# Altium schematic sheet IMU.SchDoc
size 381 x 241 mm
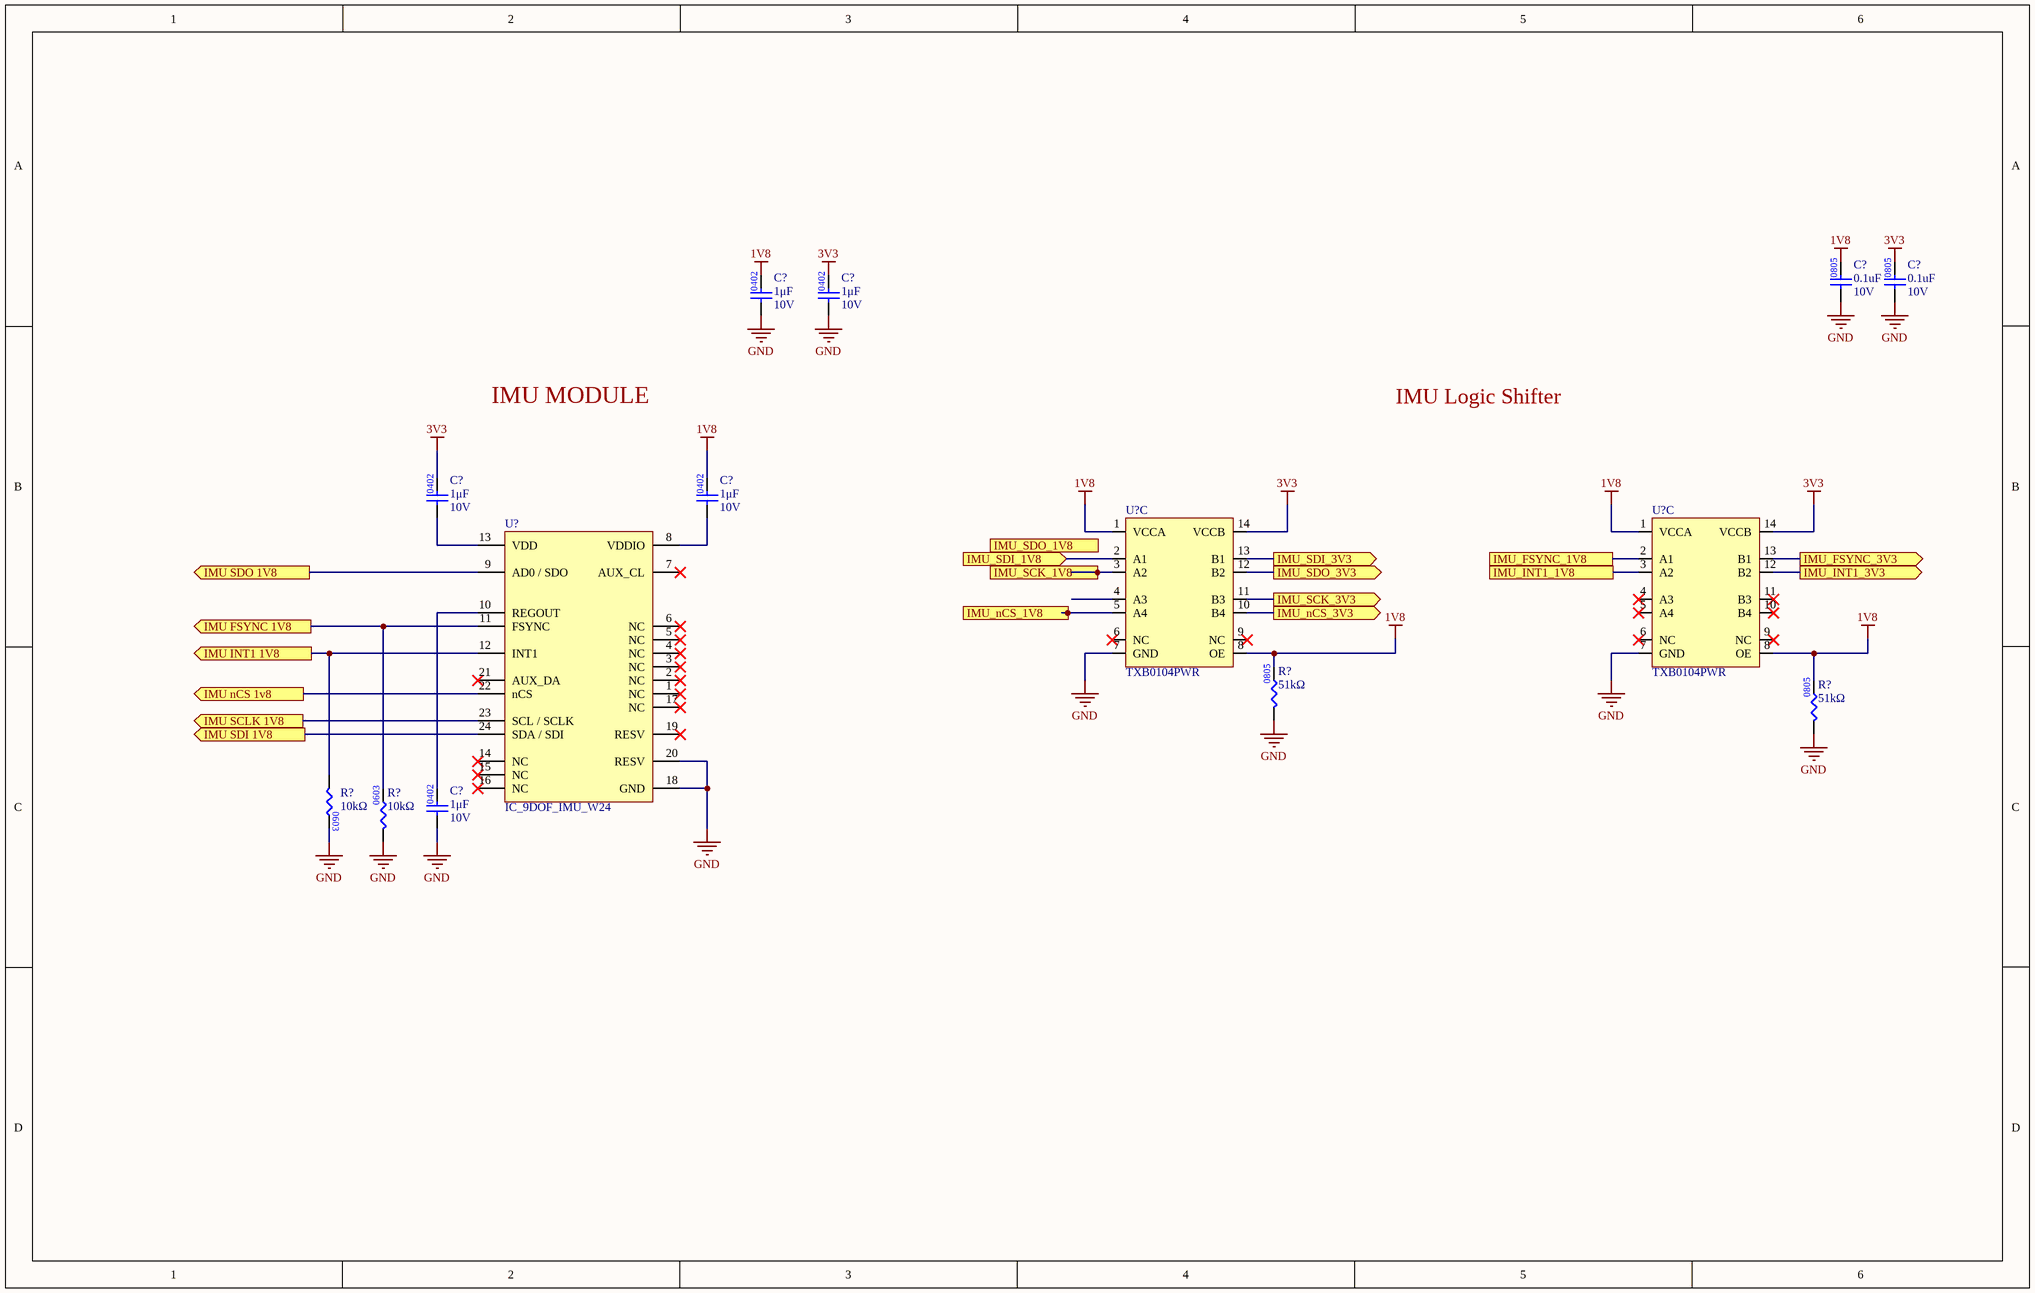
[diagram p0: IMU.SchDoc]

## Parts
(Parts that share a designator on the sheet are numbered #1, #2 ... from top to bottom, then left to right.)
C?#1  value 0.1uF  Voltage Rating: 10V  [CAP0805]  (hidden comment: CAP_0.1uF_10V_0805)
C?#2  value 0.1uF  Voltage Rating: 10V  [CAP0805]  (hidden comment: CAP_0.1uF_10V_0805)
C?#3  Capacitance: 1μF  Rated DC Voltage (URdc): 10V  [CAP0402]  (hidden comment: CAP_1UF_10V_0402_X5R)
C?#4  Capacitance: 1μF  Rated DC Voltage (URdc): 10V  [CAP0402]  (hidden comment: CAP_1UF_10V_0402_X5R)
C?#5  Capacitance: 1μF  Rated DC Voltage (URdc): 10V  [CAP0402]  (hidden comment: CAP_1UF_10V_0402_X5R)
C?#6  Capacitance: 1μF  Rated DC Voltage (URdc): 10V  [CAP0402]  (hidden comment: CAP_1UF_10V_0402_X5R)
C?#7  Capacitance: 1μF  Rated DC Voltage (URdc): 10V  [CAP0402]  (hidden comment: CAP_1UF_10V_0402_X5R)
R?#1  value 51kΩ  [RES0805]  (hidden comment: RES_51kΩ_0805_5%)
R?#2  value 51kΩ  [RES0805]  (hidden comment: RES_51kΩ_0805_5%)
R?#3  value 10kΩ  [RES0603]  (hidden comment: RES_10kΩ_0603_5%)
R?#4  value 10kΩ  [RES0603]  (hidden comment: RES_10kΩ_0603_5%)
U?#1  TXB0104PWR  [TXB0104PWR 4-bit bidirectional voltage-level translator]  (part C of 3)
U?#2  TXB0104PWR  [TXB0104PWR 4-bit bidirectional voltage-level translator]  (part C of 3)
U?#3  IC_9DOF_IMU_W24  [ICM20948 - 9DOFIMU]

## Ports
IMU FSYNC 1V8 (out), IMU INT1 1V8 (out), IMU nCS 1v8 (out), IMU SCLK 1V8 (out), IMU SDI 1V8 (out), IMU SDO 1V8 (out), IMU_FSYNC_1V8, IMU_FSYNC_3V3 (out), IMU_INT1_1V8, IMU_INT1_3V3 (out), IMU_nCS_1V8 (in), IMU_nCS_3V3 (out), IMU_SCK_1V8 (in), IMU_SCK_3V3 (out), IMU_SDI_1V8 (in), IMU_SDI_3V3 (out), IMU_SDO_1V8 (in), IMU_SDO_3V3 (out)

## Nets
1V8: C?#1.2 C?#3.2 C?#6.2 R?#1.2 R?#2.2 U?#1.1(VCCA) U?#1.8(OE) U?#2.1(VCCA) U?#2.8(OE)
3V3: C?#2.2 C?#4.2 C?#5.2 U?#1.14(VCCB) U?#2.14(VCCB)
GND: C?#1.1 C?#2.1 C?#3.1 C?#4.1 C?#7.1 R?#1.1 R?#2.1 R?#3.2 R?#4.1 U?#1.7(GND) U?#2.7(GND) U?#3.18(GND) U?#3.20(RESV)
IMU FSYNC 1V8: R?#4.2 U?#3.11(FSYNC) ; port IMU FSYNC 1V8
IMU INT1 1V8: R?#3.1 U?#3.12(INT1) ; port IMU INT1 1V8
IMU nCS 1v8: U?#3.22(nCS) ; port IMU nCS 1v8
IMU SCLK 1V8: U?#3.23(SCL_/_SCLK) ; port IMU SCLK 1V8
IMU SDI 1V8: U?#3.24(SDA_/_SDI) ; port IMU SDI 1V8
IMU SDO 1V8: U?#3.9(AD0_/_SDO) ; port IMU SDO 1V8
IMU_FSYNC_1V8: U?#2.2(A1) ; port IMU_FSYNC_1V8
IMU_FSYNC_3V3: U?#2.13(B1) ; port IMU_FSYNC_3V3
IMU_INT1_1V8: U?#2.3(A2) ; port IMU_INT1_1V8
IMU_INT1_3V3: U?#2.12(B2) ; port IMU_INT1_3V3
IMU_nCS_1V8: U?#1.5(A4) ; port IMU_nCS_1V8
IMU_nCS_3V3: U?#1.10(B4) ; port IMU_nCS_3V3
IMU_SCK_1V8: U?#1.3(A2) ; port IMU_SCK_1V8
IMU_SCK_3V3: U?#1.11(B3) ; port IMU_SCK_3V3
IMU_SDI_1V8: U?#1.2(A1) ; port IMU_SDI_1V8
IMU_SDI_3V3: U?#1.13(B1) ; port IMU_SDI_3V3
IMU_SDO_3V3: U?#1.12(B2) ; port IMU_SDO_3V3
NetC?#5_1: C?#5.1 U?#3.13(VDD)
NetC?#6_1: C?#6.1 U?#3.8(VDDIO)
NetC?#7_2: C?#7.2 U?#3.10(REGOUT)

Not connected (* = marked no-connect by the designer): U?#1 4(A3) 6(NC)* 9(NC)*; U?#2 4(A3)* 5(A4)* 6(NC)* 9(NC)* 10(B4)* 11(B3)*; U?#3 1(NC)* 2(NC)* 3(NC)* 4(NC)* 5(NC)* 6(NC)* 7(AUX_CL)* 14(NC)* 15(NC)* 16(NC)* 17(NC)* 19(RESV)* 21(AUX_DA)*

## Notes on the sheet
- IMU MODULE
- IMU Logic Shifter
- (in symbol RES_51kΩ_0805_5%) 0805

## Library data of the parts
C?#1 C?#2 = CAP_0.1uF_10V_0805: CAP CER 0.1uF 10V 0805; Manufacturer 1: KEMET; Manufacturer Part Number 1: C0805C104K8RAC7800; Package/Footprint: 0805; Supplier 1: Digi-Key; Supplier Part Number 1: 399-C0805C104K8RAC7800DKR-ND
C?#3-C?#7 = CAP_1UF_10V_0402_X5R: CAP CER 1UF 10V X5R 0402; Manufacturer: Kyocera AVX; Manufacturer Part Number: 0402ZD105MAT2A; Supplier 1: Digi-Key; Supplier Part Number 1: 478-5768-1-ND; Mounting Type: Surface Mount; Package: 0402; Temperature Characteristics Code: X5R; ComponentLink7URL: https://datasheet.ciiva.com/11531/cx5r-11531784.pdf?src-supplier=Avnet; ComponentLink7Description: https://datasheet.ciiva.com/11531/cx5r-11531784.pdf?src-supplier=Avnet
R?#1 R?#2 = RES_51kΩ_0805_5%: RES 51K OHM 1% 1/8W 0805; Manufacturer 1: Vishay Dale; Manufacturer Part Number 1: CRCW080551K0FKEA; Supplier 1: Digi-Key; Supplier Part Number 1: 541-51.0KCCT-ND
R?#3 R?#4 = RES_10kΩ_0603_5%: RES 10K OHM 5% 1/10W 0603; Manufacturer 1: Yageo; Manufacturer Part Number 1: RC0603JR-0710KL; Supplier Part Number 1: 311-10KGRCT-ND; Supplier 1: Digi-Key; Mounting Type: SMD; Package: 0603
U?#1 U?#2 = IC_Bidirectional_Level_Shifter: Voltage Level Translator Bidirectional 1 Circuit 4 Channel 100Mbps 14-TSSOP; Manufacturer: Texas Instruments; Manufacture product number: TXB0104PWR; Supplier: Digikey; Mounting type: Surface Mount; Package: 14-TSSOP; ComponentLink1Description: Datasheet; ComponentLink1URL: https://www.digikey.ca/en/products/detail/texas-instruments/TXB0104PWR/1629102
U?#3 = IC_9DOF_IMU_W24: Accelerometer, Gyroscope, Magnetometer, 9 Axis Sensor I2C, SPI Output; Manufacturer 1: TDK InvenSense; Manufacturer Product Number: ICM-20948; DigiKey Part Number: 1428-1123-6-ND; Package / Case: 24-TFQFN Module Exposed Pad; Supplier: DigiKey; Mounting Type: Surface Mount